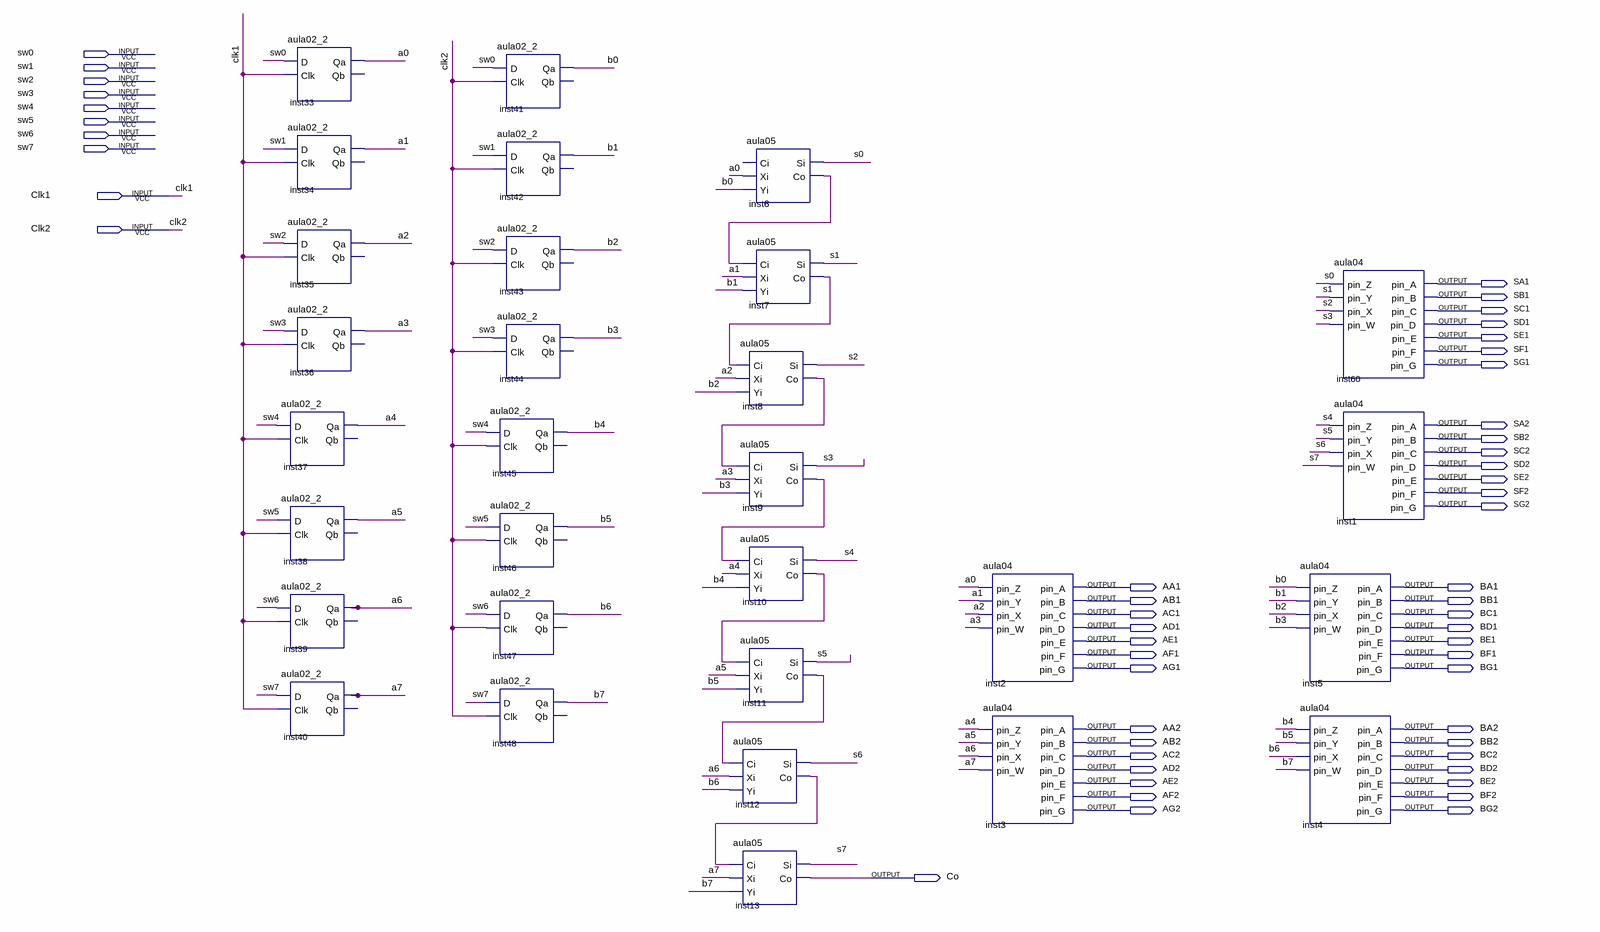
[diagram p0: schematic sheet]
// Quartus schematic aula02_05.bdf as structural Verilog: 30 symbols, 53 pins
module aula02_05 (
  input  sw0,
  input  sw1,
  input  sw2,
  input  sw3,
  input  sw4,
  input  sw5,
  input  sw6,
  input  sw7,
  input  Clk1,
  input  Clk2,
  output SA1,
  output SB1,
  output SC1,
  output SD1,
  output SE1,
  output SF1,
  output SG1,
  output SA2,
  output SB2,
  output SC2,
  output SD2,
  output SE2,
  output SF2,
  output SG2,
  output AA1,
  output BA1,
  output AB1,
  output BB1,
  output AC1,
  output BC1,
  output AD1,
  output BD1,
  output AE1,
  output BE1,
  output AF1,
  output BF1,
  output AG1,
  output BG1,
  output AA2,
  output BA2,
  output AB2,
  output BB2,
  output AC2,
  output BC2,
  output AD2,
  output BD2,
  output AE2,
  output BE2,
  output AF2,
  output BF2,
  output AG2,
  output BG2,
  output Co
);

  wire a0, a1, a2, a3, a4, a5, a6, a7, b0, b1, b2, b3, b4, b5, b6, b7, inst6_co, inst7_co, inst8_co,
       inst9_co, inst10_co, inst11_co, inst12_co, inst13_si, s0, s1, s2, s3, s4, s5, s6;

  aula02_2 inst33 (.D(sw0), .Clk(Clk1), .Qa(a0));  // open: Qb
  aula02_2 inst34 (.D(sw1), .Clk(Clk1), .Qa(a1));  // open: Qb
  aula02_2 inst35 (.D(sw2), .Clk(Clk1), .Qa(a2));  // open: Qb
  aula02_2 inst36 (.D(sw3), .Clk(Clk1), .Qa(a3));  // open: Qb
  aula02_2 inst37 (.D(sw4), .Clk(Clk1), .Qa(a4));  // open: Qb
  aula02_2 inst38 (.D(sw5), .Clk(Clk1), .Qa(a5));  // open: Qb
  aula02_2 inst39 (.D(sw6), .Clk(Clk1), .Qa(a6));  // open: Qb
  aula02_2 inst40 (.D(sw7), .Clk(Clk1), .Qa(a7));  // open: Qb
  aula02_2 inst41 (.D(sw0), .Clk(Clk2), .Qa(b0));  // open: Qb
  aula02_2 inst42 (.D(sw1), .Clk(Clk2), .Qa(b1));  // open: Qb
  aula02_2 inst43 (.D(sw2), .Clk(Clk2), .Qa(b2));  // open: Qb
  aula02_2 inst44 (.D(sw3), .Clk(Clk2), .Qa(b3));  // open: Qb
  aula02_2 inst45 (.D(sw4), .Clk(Clk2), .Qa(b4));  // open: Qb
  aula02_2 inst46 (.D(sw5), .Clk(Clk2), .Qa(b5));  // open: Qb
  aula02_2 inst47 (.D(sw6), .Clk(Clk2), .Qa(b6));  // open: Qb
  aula02_2 inst48 (.D(sw7), .Clk(Clk2), .Qa(b7));  // open: Qb
  aula05 inst6 (.Xi(a0), .Yi(b0), .Si(s0), .Co(inst6_co));  // open: Ci
  aula05 inst7 (.Ci(inst6_co), .Xi(a1), .Yi(b1), .Si(s1), .Co(inst7_co));
  aula05 inst8 (.Ci(inst7_co), .Xi(a2), .Yi(b2), .Si(s2), .Co(inst8_co));
  aula05 inst9 (.Ci(inst8_co), .Xi(a3), .Yi(b3), .Si(s3), .Co(inst9_co));
  aula05 inst10 (.Ci(inst9_co), .Xi(a4), .Yi(b4), .Si(s4), .Co(inst10_co));
  aula05 inst11 (.Ci(inst10_co), .Xi(a5), .Yi(b5), .Si(s5), .Co(inst11_co));
  aula05 inst12 (.Ci(inst11_co), .Xi(a6), .Yi(b6), .Si(s6), .Co(inst12_co));
  aula05 inst13 (.Ci(inst12_co), .Xi(a7), .Yi(b7), .Si(inst13_si), .Co(Co));
  aula04 inst2 (
    .pin_Z(a0), .pin_Y(a1), .pin_X(a2), .pin_W(a3), .pin_A(AA1), .pin_B(AB1), .pin_C(AC1), .pin_D(AD1),
    .pin_E(AE1), .pin_F(AF1), .pin_G(AG1));
  aula04 inst3 (
    .pin_Z(a4), .pin_Y(a5), .pin_X(a6), .pin_W(a7), .pin_A(AA2), .pin_B(AB2), .pin_C(AC2), .pin_D(AD2),
    .pin_E(AE2), .pin_F(AF2), .pin_G(AG2));
  aula04 inst60 (
    .pin_Z(s0), .pin_Y(s1), .pin_X(s2), .pin_W(s3), .pin_A(SA1), .pin_B(SB1), .pin_C(SC1), .pin_D(SD1),
    .pin_E(SE1), .pin_F(SF1), .pin_G(SG1));
  aula04 inst1 (
    .pin_Z(s4), .pin_Y(s5), .pin_X(s6), .pin_W(Co), .pin_A(SA2), .pin_B(SB2), .pin_C(SC2), .pin_D(SD2),
    .pin_E(SE2), .pin_F(SF2), .pin_G(SG2));
  aula04 inst5 (
    .pin_Z(b0), .pin_Y(b1), .pin_X(b2), .pin_W(b3), .pin_A(BA1), .pin_B(BB1), .pin_C(BC1), .pin_D(BD1),
    .pin_E(BE1), .pin_F(BF1), .pin_G(BG1));
  aula04 inst4 (
    .pin_Z(b4), .pin_Y(b5), .pin_X(b6), .pin_W(b7), .pin_A(BA2), .pin_B(BB2), .pin_C(BC2), .pin_D(BD2),
    .pin_E(BE2), .pin_F(BF2), .pin_G(BG2));

  // Other names for the same wires on the sheet: s7 = Co
endmodule
